# Altium schematic sheet WIFI_BT.SchDoc
size A3
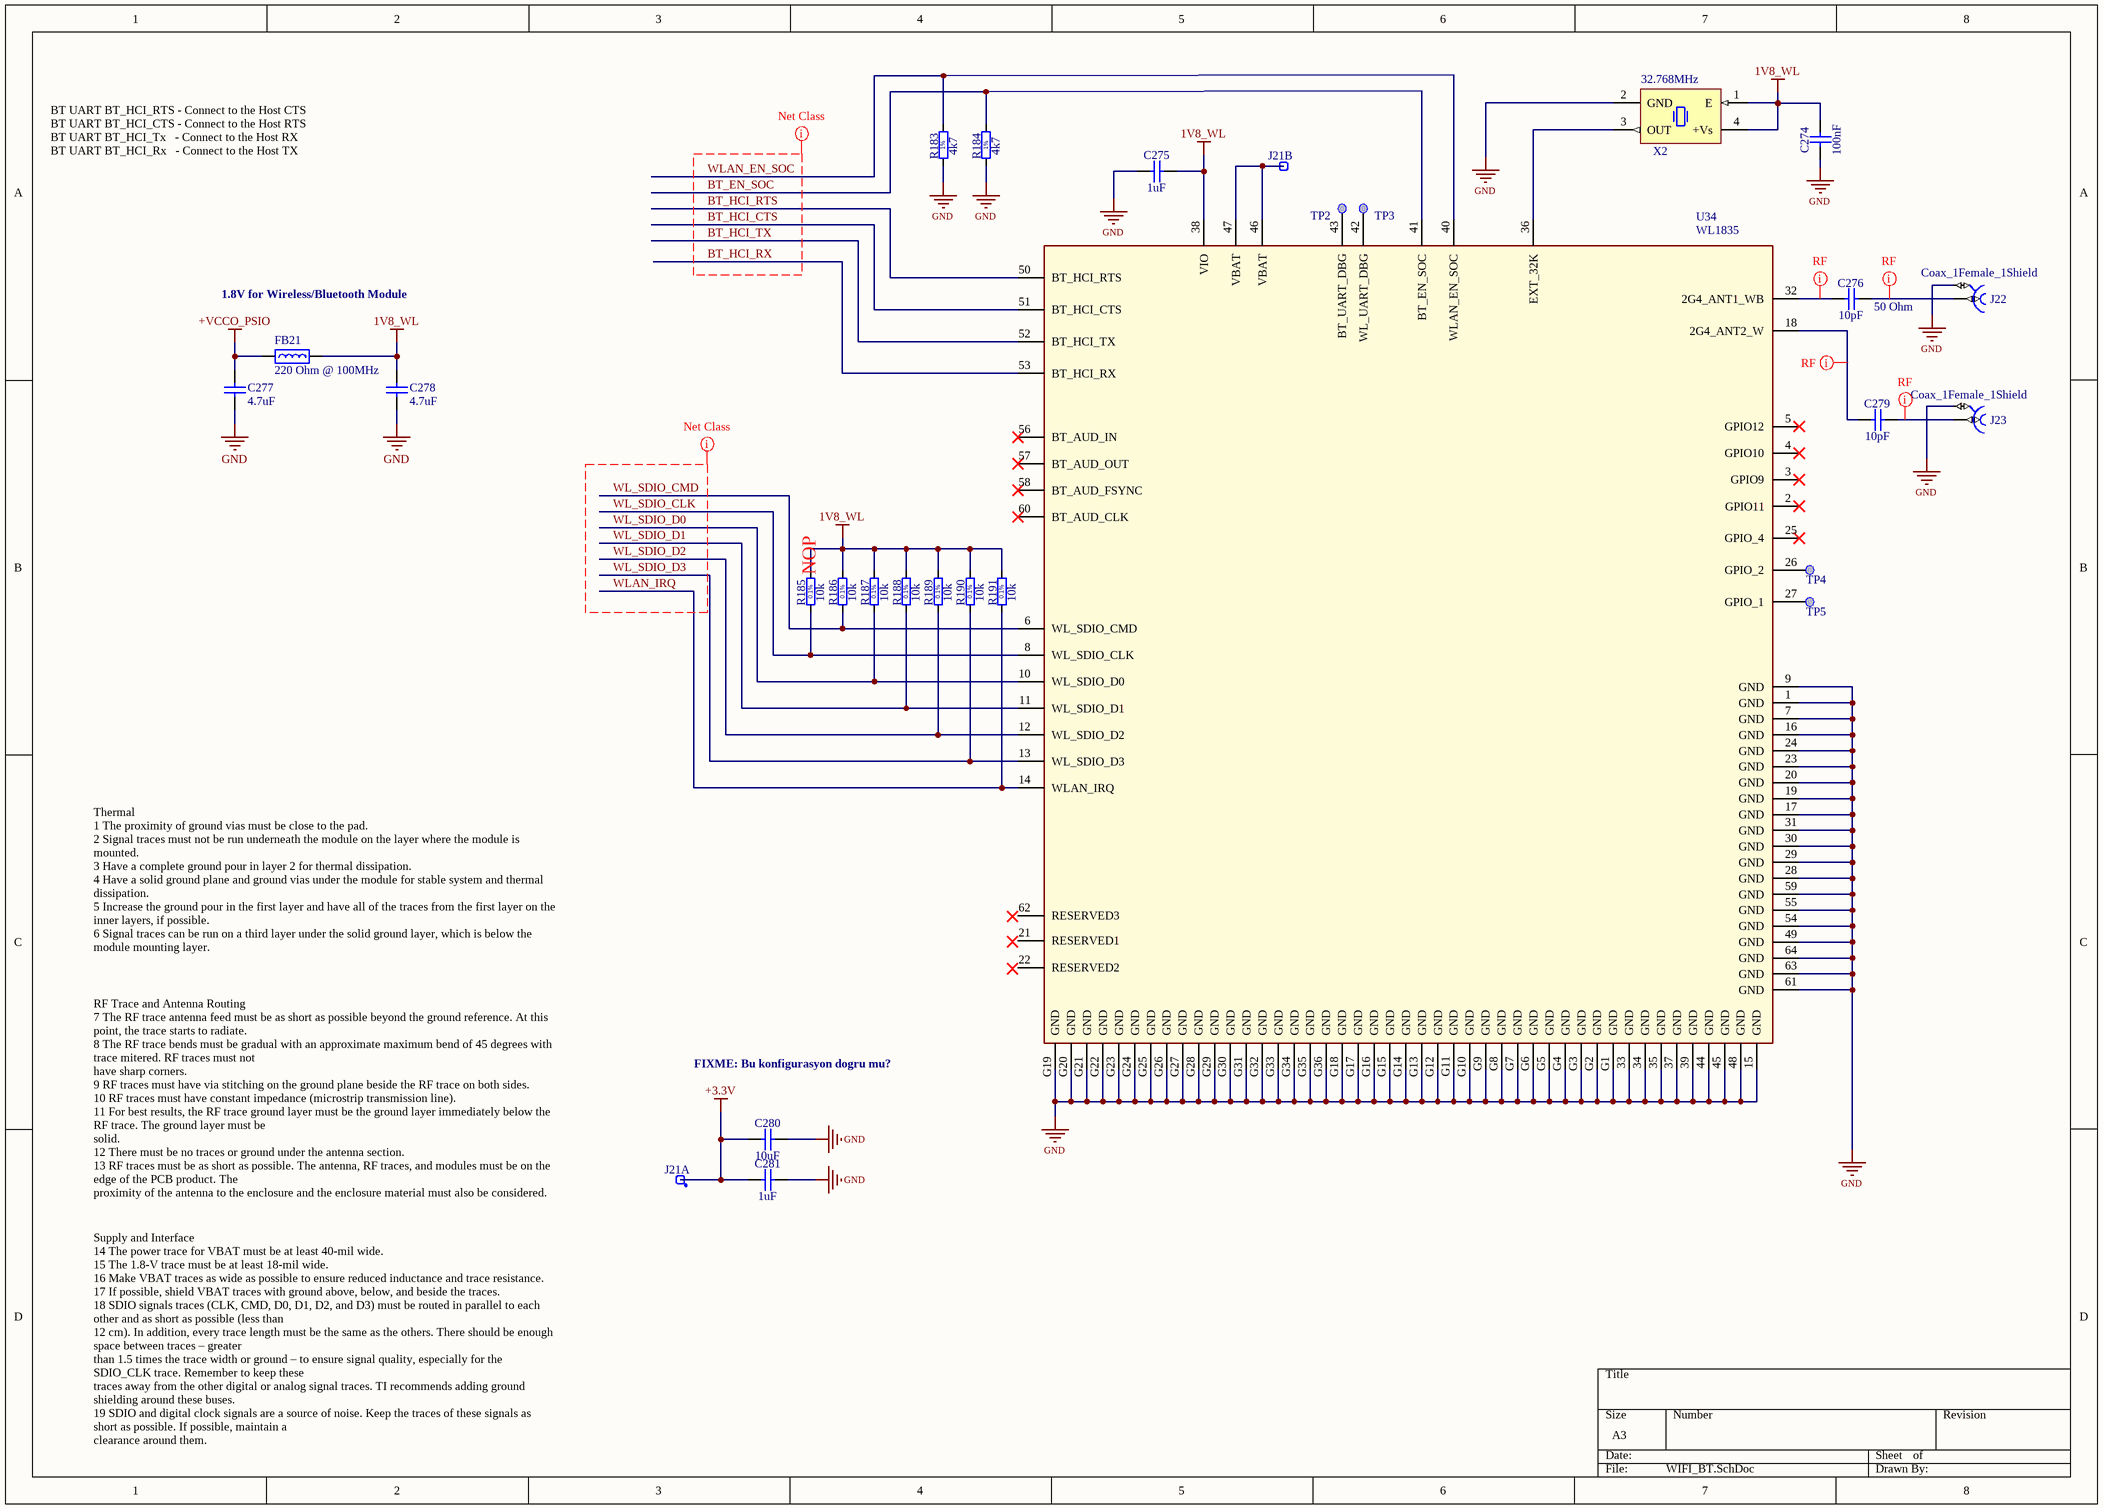
[diagram p0: WIFI_BT.SchDoc]

## Parts
C274  100nF  [CAPC1608X87N]
C275  1uF  [CAPC1608X87N]
C276  10pF  [CAPC1608X87N]
C277  4.7uF  [CAPC1005L_0402]
C278  4.7uF  [CAPC1005L_0402]
C279  10pF  [CAPC1608X87N]
C280  10uF  [CAPC2012X135N]
C281  1uF  [CAPC1608X87N]
FB21  Impedance @ Frequency: 220 Ohm @ 100MHz  [INDC1608N_0603]  (hidden comment: BEAD0603_220_2A5_40M)
J21  Test Point  [COMATEL_385.0358.1.02.400]  (value not drawn)  (parts A,B of 2)
J22  Coax_1Female_1Shield  [HUBER-SUHNER_82 SMA-50-0-41/133 NE]
J23  Coax_1Female_1Shield  [HUBER-SUHNER_82 SMA-50-0-41/133 NE]
R183  4k7  [RESC1608X55N]
R184  4k7  [RESC1608X55N]
R185  10k  [RESC1608X55N]
R186  10k  [RESC1608X55N]
R187  10k  [RESC1608X55N]
R188  10k  [RESC1608X55N]
R189  10k  [RESC1608X55N]
R190  10k  [RESC1608X55N]
R191  10k  [RESC1608X55N]
TP2  TP  [TP]  (value not drawn)  (no BOM)
TP3  TP  [TP]  (value not drawn)  (no BOM)
TP4  TP  [TP]  (value not drawn)  (no BOM)
TP5  TP  [TP]  (value not drawn)  (no BOM)
U34  WL1835  [E-13.4X13.3-N100_0.75-TOP]
X2  32.768MHz  [OSCSC508P500X700X180-4N]

## Nets
1V8_WL: C274.2 C275.2 C278.2 FB21.2 R185.2 R186.2 R187.2 R188.2 R189.2 R190.2 R191.2 U34.38(VIO) X2.1(E) X2.4(+Vs)
+3.3V: C280.1 C281.1 J21.1
+VCCO_PSIO: C277.2 FB21.1
GND: C274.1 C275.1 C277.1 C278.1 C280.2 C281.2 J22.2 J23.2 R183.1 R184.1 U34.1(GND) U34.7(GND) U34.9(GND) U34.15(GND) U34.16(GND) U34.17(GND) U34.19(GND) U34.20(GND) U34.23(GND) U34.24(GND) U34.28(GND) U34.29(GND) U34.30(GND) U34.31(GND) U34.33(GND) U34.34(GND) U34.35(GND) U34.37(GND) U34.39(GND) U34.44(GND) U34.45(GND) U34.48(GND) U34.49(GND) U34.54(GND) U34.55(GND) U34.59(GND) U34.61(GND) U34.63(GND) U34.64(GND) U34.G1(GND) U34.G2(GND) U34.G3(GND) U34.G4(GND) U34.G5(GND) U34.G6(GND) U34.G7(GND) U34.G8(GND) U34.G9(GND) U34.G10(GND) U34.G11(GND) U34.G12(GND) U34.G13(GND) U34.G14(GND) U34.G15(GND) U34.G16(GND) U34.G17(GND) U34.G18(GND) U34.G19(GND) U34.G20(GND) U34.G21(GND) U34.G22(GND) U34.G23(GND) U34.G24(GND) U34.G25(GND) U34.G26(GND) U34.G27(GND) U34.G28(GND) U34.G29(GND) U34.G30(GND) U34.G31(GND) U34.G32(GND) U34.G33(GND) U34.G34(GND) U34.G35(GND) U34.G36(GND) X2.2(GND)
BT_EN_SOC: R184.2 U34.41(BT_EN_SOC)
BT_HCI_CTS: U34.51(BT_HCI_CTS)
BT_HCI_RTS: U34.50(BT_HCI_RTS)
BT_HCI_RX: U34.53(BT_HCI_RX)
BT_HCI_TX: U34.52(BT_HCI_TX)
WL_SDIO_CLK: R185.1 U34.8(WL_SDIO_CLK)
WL_SDIO_CMD: R186.1 U34.6(WL_SDIO_CMD)
WL_SDIO_D0: R187.1 U34.10(WL_SDIO_D0)
WL_SDIO_D1: R188.1 U34.11(WL_SDIO_D1)
WL_SDIO_D2: R189.1 U34.12(WL_SDIO_D2)
WL_SDIO_D3: R190.1 U34.13(WL_SDIO_D3)
WLAN_EN_SOC: R183.2 U34.40(WLAN_EN_SOC)
WLAN_IRQ: R191.1 U34.14(WLAN_IRQ)
NetC276_1: C276.1 U34.32(2G4_ANT1_WB)
NetC276_2: C276.2 J22.1
NetC279_1: C279.1 U34.18(2G4_ANT2_W)
NetC279_2: C279.2 J23.1
NetJ21_2: J21.2 U34.46(VBAT) U34.47(VBAT)
NetTP2_1: TP2.1 U34.43(BT_UART_DBG)
NetTP3_1: TP3.1 U34.42(WL_UART_DBG)
NetTP4_1: TP4.1 U34.26(GPIO_2)
NetTP5_1: TP5.1 U34.27(GPIO_1)
NetU34_36: U34.36(EXT_32K) X2.3(OUT)

Not connected (* = marked no-connect by the designer): U34 2(GPIO11)* 3(GPIO9)* 4(GPIO10)* 5(GPIO12)* 21(RESERVED1) 22(RESERVED2) 25(GPIO_4)* 56(BT_AUD_IN)* 57(BT_AUD_OUT)* 58(BT_AUD_FSYNC)* 60(BT_AUD_CLK)* 62(RESERVED3)

## Layout directives
net class RF: NetC276_1, NetC276_2, NetC279_1, NetC279_2
net class BLU_SPI: BT_EN_SOC, BT_HCI_CTS, BT_HCI_RTS, BT_HCI_RX, BT_HCI_TX, WLAN_EN_SOC
net class WL_SDIO: WL_SDIO_CLK, WL_SDIO_CMD, WL_SDIO_D0, WL_SDIO_D1, WL_SDIO_D2, WL_SDIO_D3, WLAN_IRQ

## Notes on the sheet
- BT UART	BT_HCI_RTS - Connect to the Host CTS
  BT UART	BT_HCI_CTS - Connect to the Host RTS
  BT UART	BT_HCI_Tx   - Connect to the Host RX
  BT UART	BT_HCI_Rx   - Connect to the Host TX
- 1.8V for Wireless/Bluetooth Module
- (near C276) 50 Ohm
- (near R185) NOP
- Thermal
  1 The proximity of ground vias must be close to the pad.
  2 Signal traces must not be run underneath the module on the layer where the module is mounted.
  3 Have a complete ground pour in layer 2 for thermal dissipation.
  4 Have a solid ground plane and ground vias under the module for stable system and thermal dissipation.
  5 Increase the ground pour in the first layer and have all of the traces from the first layer on the inner layers, if possible.
  6 Signal traces can be run on a third layer under the solid ground layer, which is below the module mounting layer.
- FIXME: Bu konfigurasyon dogru mu?
- RF Trace and Antenna Routing
  7 The RF trace antenna feed must be as short as possible beyond the ground reference. At this point, the trace starts to radiate.
  8 The RF trace bends must be gradual with an approximate maximum bend of 45 degrees with trace mitered. RF traces must not
  have sharp corners.
  9 RF traces must have via stitching on the ground plane beside the RF trace on both sides.
  10 RF traces must have constant impedance (microstrip transmission line).
  11 For best results, the RF trace ground layer must be the ground layer immediately below the RF trace. The ground layer must be
  solid.
  12 There must be no traces or ground under the antenna section.
  13 RF traces must be as short as possible. The antenna, RF traces, and modules must be on the edge of the PCB product. The
  proximity of the antenna to the enclosure and the enclosure material must also be considered.
- Supply and Interface
  14 The power trace for VBAT must be at least 40-mil wide.
  15 The 1.8-V trace must be at least 18-mil wide.
  16 Make VBAT traces as wide as possible to ensure reduced inductance and trace resistance.
  17 If possible, shield VBAT traces with ground above, below, and beside the traces.
  18 SDIO signals traces (CLK, CMD, D0, D1, D2, and D3) must be routed in parallel to each other and as short as possible (less than
  12 cm). In addition, every trace length must be the same as the others. There should be enough space between traces – greater
  than 1.5 times the trace width or ground – to ensure signal quality, especially for the SDIO_CLK trace. Remember to keep these
  traces away from the other digital or analog signal traces. TI recommends adding ground shielding around these buses.
  19 SDIO and digital clock signals are a source of noise. Keep the traces of these signals as short as possible. If possible, maintain a
  clearance around them.
- (in symbol R0603_4K7_1%_0.1W_100PPM) 1%
- (in symbol R0603_10K_0.1%_0.063W_10PPM) 0.1%

## Library data of the parts
C274 = CC0603_100NF_50V_10%_X7R: Non-polarised capacitor; Part Description: SMD Multilayer Chip Ceramic Capacitor; Manufacturer: MULTICOMP; Manufacturer Part Number: MCB0603R104KCT; Manufacturer1 Part Number: 223858615649; Voltage: 50V; TC: X7R; Tolerance: ±10%; Table: Capacitors SMD; Voltage Rating: 16; Capacitance Tolerance ±: ± 10%; Dielectric Characteristic: X7; Capacitance: 0.1; SVHC: No SVHC (17-Dec-2015); Capacitor Terminals: SMD; Ceramic Capacitor Case: 0603 [1608 Metric]; Product Range: MCB Series; Part Number: CC0603_100NF_50V_10%_X7R; Component Kind: Standard; Component Type: Standard; Pin Count: 2; Value: 100nF; Status: Preferred; Case: 0603; Mounted: Yes; Socket: No; SMD: Yes; Manufacturer1 Example: PHYCOMP; Manufacturer1 ComponentHeight: 0.87mm; HelpURL: \\cern.ch\dfs\Applications\Altium\Datasheets\CC0603_X7R_PHYCOMP.pdf; Author: CERN DEM JLC; CreateDate: 03.12.2007; LatestRevisionDate: 03.12.2007; Supplier: Farnell; Capacitance Tolerance: ± 10%; Supplier Part Number: 9406140; RoHS: YES; Packaging: Cut Tape; MSL: -; Operating Temperature Max: 125; Operating Temperature Range: -55°C to +125°C<!--FANDB--><div class="features-and-benefits-container"><div class="features-and-benefits-description"><span class="features-benefits-value">The MCB0603R104KCT is a multilayer Ceramic Capacitor with 0603 chip, for general digital circuit. Consists of a conducting material and electrodes. To manufacture a chip-type SMT and achieve miniaturization, high density and high efficiency, ceramic condensers are used. MLCC is made by X7; Operating Temperature Min: -55
C275 C281 = CC0603_1UF_25V_10%_X7R: Non-polarised capacitor; Part Description: SMD Multilayer Chip Ceramic Capacitor; Manufacturer: MULTICOMP; Manufacturer Part Number: MC0603F104Z250CT; Manufacturer1 Part Number: GRM188R71E105KA12D; Voltage: 25V; TC: X7R; Tolerance: ±10%; Table: Capacitors SMD; Capacitance: 0.1; Capacitance Tolerance: +80%, -20%; No. of Pins: 2; Product Range: MC Series; External Length / Height: 0.8; Dielectric Characteristic: Y5; Ceramic Capacitor Case: 0603 [1608 Metric]; Capacitor Terminals: SMD; External Depth: 1.6; SVHC: No SVHC (17-Dec-2015); Voltage Rating: 25; Part Number: CC0603_1UF_25V_10%_X7R; Component Kind: Standard; Component Type: Standard; Pin Count: 2; Value: 1uF; Status: None; Case: 0603; Mounted: Yes; Socket: No; SMD: Yes; Manufacturer1 Example: MURATA; Manufacturer1 ComponentHeight: 0.9mm; HelpURL: \\cern.ch\dfs\Applications\Altium\Datasheets\CC0603_X7R_MURATA.pdf; Author: CERN DEM JLC; CreateDate: 18.01.2011; LatestRevisionDate: 18.01.2011; MSL: -; Supplier Part Number: 1759038; Capacitance Tolerance ±: +80%, -20%; External Width: 0.8; Operating Temperature Range: -25°C to +85°C<!--FANDB--><div class="features-and-benefits-container"><div class="features-and-benefits-description"><span class="features-benefits-value">The MC0603F104Z250CT is a general purpose Multilayer Ceramic Capacitor with Cu/Ni/Sn-plated termination, Y5V dielectric and 0603 case. The multilayer ceramic capacitor consists of a conducting material and electrodes. To manufacture a chip-type SMT and achieve miniaturization, high density and high efficiency, ceramic condensers are used. High electrical precision, stability and reliability.</span></div><div class="features-and-benefits-list"><ul class="features-and-benefits-list-list"><li class="features-and-benefits-list-item">High capacitance</li></ul></div><div class="features-and-benefits-applications"><ul class="features-and-benefits-value"><li class="features-and-benefits-list-item">Power Management</li><li class="features-and-benefits-list-item">Consumer Electronics</li><li class="features-and-benefits-list-item">Communications & Networking</li></ul></div></div>; Supplier: Farnell; Packaging: Cut Tape; Operating Temperature Max: 85; Operating Temperature Min: -30; RoHS: YES
C276 C279 = CC0603_10PF_50V_5%_NP0: Non-polarised capacitor; Part Description: SMD Multilayer Chip Ceramic Capacitor; Manufacturer: Yageo; Manufacturer Part Number: CC0603JRNPO9BN100; Manufacturer1 Part Number: 223886715109; Voltage: 50V; TC: NP0; Tolerance: ±5%; Table: Capacitors SMD; Temperature Coefficient: C0G, NP0; Part Number: CC0603_10PF_50V_5%_NP0; Component Kind: Standard; Component Type: Standard; Pin Count: 2; Value: 10pF; Status: Preferred; Case: 0603; Mounted: Yes; Socket: No; SMD: Yes; Manufacturer1 Example: PHYCOMP; Manufacturer1 ComponentHeight: 0.87mm; HelpURL: \\cern.ch\dfs\Applications\Altium\Datasheets\CC0603_NP0_PHYCOMP.pdf; Author: CERN DEM JLC; CreateDate: 3.12.2007; LatestRevisionDate: 3.12.2007; Packaging: Tape & Reel (TR); Features: -; RoHS: RoHS Compliant; Applications: General Purpose; Category: Capacitors; Operating Temperature: -55°C ~ 125°C; Height - Seated (Max): -; Supplier Part Number: 311-1058-2-ND; Ratings: -; Lead Style: -; Thickness (Max): 0.035" (0.90mm); Lead Spacing: -; Mounting Type: Surface Mount, MLCC; Size / Dimension: 0.063" L x 0.031" W (1.60mm x 0.80mm); Voltage - Rated: 50V; Supplier: Digi-Key; Package / Case: 0603 (1608 Metric); Capacitance: 10pF
C277 C278 = CAPCER0402X5R4U710V_10T: CAP CER 4.7UF 10V X5R 0402; Manufacturer 1: TDK Corporation; Manufacturer Part Number 1: C1005X5R1A475K050BC; Tolerance: 10%; Package: 0402; ComponentLink1Description: Datasheet; Value: 4.7uF; Voltage: 10V; Temperature Coefficient: x5R; Supplier 1: Digi-Key; Supplier Part Number 1: 445-13820-1-ND; Operating Temperature: -55°C ~ 85°C
C280 = CC0805_10UF_10V_10%_X7R: Non-polarised capacitor; Part Description: SMD Multilayer Chip Ceramic Capacitor; Manufacturer: MULTICOMP; Manufacturer Part Number: MC0805X106K250CT; Manufacturer1 Part Number: GRM21BR71A106KE51L; Voltage: 10V; TC: X7R; Tolerance: ±10%; Table: Capacitors SMD; Product Range: MC Series; Voltage Rating: 25; Capacitor Terminals: SMD<!--FANDB--><div class="features-and-benefits-container"><div class="features-and-benefits-description"><span class="features-benefits-value">The MC series from Multicomp are general purpose MLCC capacitors with X5R dielectric material which provides high electrical precision, stability and reliability. This MLCC capacitor consists of a conducting material and electrodes with high density and high efficiency ceramic condensers.</span></div><div class="features-and-benefits-list"><ul class="features-and-benefits-list-list"><li class="features-and-benefits-list-item">Small size with higher capacitance values</li><li class="features-and-benefits-list-item">0201, 0402, 0603, 0805, 1206, 1210, 1812 case sizes available</li><li class="features-and-benefits-list-item">Capacitance values ranges from 100pF to 220?F</li><li class="features-and-benefits-list-item">Capacitor with lead free termination (pure Tin)</li><li class="features-and-benefits-list-item">High electrical precision, stability and reliability</li><li class="features-and-benefits-list-item">Rated voltage of 4V, 6.3V, 10V, 16V, 25V, 50V</li><li class="features-and-benefits-list-item">Operating temperature range -55°C to +85°C</li><li class="features-and-benefits-list-item">Available in ±10% and ±20; Dielectric Characteristic: X5; Ceramic Capacitor Case: 0805 [2012 Metric]; Capacitance Tolerance ±: ± 10%; SVHC: No SVHC (15-Jun-2015); Capacitance: 10; Part Number: CC0805_10UF_10V_10%_X7R; Component Kind: Standard; Component Type: Standard; Pin Count: 2; Value: 10uF; Status: Preferred; Case: 0805; Mounted: Yes; Socket: No; SMD: Yes; Manufacturer1 Example: MURATA; Manufacturer1 ComponentHeight: 1.35mm; HelpURL: \\cern.ch\dfs\Applications\Altium\Datasheets\CC0805_X7R_MURATA.pdf; Author: CERN DEM JLC; CreateDate: 30.04.2012; LatestRevisionDate: 30.04.2012; Operating Temperature Min: -55; MSL: MSL 1 - Unlimited; Supplier: Farnell; RoHS: YES; Capacitance Tolerance: ± 10%; Packaging: Cut Tape; Supplier Part Number: 2320833; Operating Temperature Max: 85
FB21 = BEAD0603_220_2A5_40M: FERRITE BEAD 220 OHM 0603 1LN; Manufacturer 1: Murata Electronics North America; Manufacturer Part Number 1: BLM18SG221TN1D; Current Rating (Max): 2.5A; DC Resistance (DCR) (Max): 40 mohm; Package: 0603; ComponentLink1Description: Datasheet; ComponentLink1URL: C:\Users\Public\Documents\Altium\AD16\Library\PDF\ENFA0003.pdf; Supplier 1: Digi-Key; Supplier Part Number 1: 490-5225-1-ND; Operating Temperature: -55°C ~ 125°C
J21 = COMATEL_385.0358.1.02.400: 2 Mini Wire-Wrap Contact Strip Header; Part Description: 2 Contacts Straight Strip Header Pitch 2.54mm L=6.3mm ''Mini-Wire-Wrap''; Manufacturer: KONTEK COMATEL; Part Number: COMATEL_385.0358.1.02.400; Component Kind: Standard; Component Type: Standard; Pin Count: 2; Family: Test Point; Mounted: Yes; Socket: No; SMD: No; Status: Not recommended; Manufacturer Part Number: 385.0358.1.02.400; ComponentHeight: 8mm; HelpURL: \\cern.ch\dfs\Applications\Altium\Datasheets\COMATEL_385.0358.1.02.400.pdf; Author: CERN DEM JLC; CreateDate: 30.06.2010; LatestRevisionDate: 10.10.2012; Table: COMATEL
J22 J23 = HUBER-SUHNER_82_SMA-50-0-41/133_NE: Part Description: SMA 50 Ohms Straight PCB Jack; Manufacturer: AMPHENOL CONNEX; Manufacturer Part Number: 132134; Table: Miscellaneous; Part Number: HUBER-SUHNER_82_SMA-50-0-41/133_NE; Component Kind: Standard; Component Type: Standard; Pin Count: 2; Family: SMA; Mounted: Yes; Socket: No; SMD: No; Status: None; ComponentHeight: 9.6mm; HelpURL: \\cern.ch\dfs\Applications\Altium\Datasheets\HUBER-SUHNER_82 SMA-50-0-41-133 NE.pdf; Author: CERN DEM JLC; CreateDate: 20.04.2010; LatestRevisionDate: 27.04.2010; Supplier: Farnell; RoHS: YES; Supplier Part Number: 2112465
R183 R184 = R0603_4K7_1%_0.1W_100PPM: Resistor - 1%; Part Description: General Purpose Thick Film Chip Resistor; Manufacturer: Yageo; Manufacturer Part Number: RC0603JR-074K7L; Manufacturer1 Part Number: NRC06F4701TRF; Power: 0.1W; TC: ±100ppm/°C; Tolerance: ±5%; Table: Resistors SMD; Resistance (Ohms): 4.7k; Power (Watts): 0.1W, 1/10W; Part Number: R0603_4K7_1%_0.1W_100PPM; Component Kind: Standard; Component Type: Standard; Pin Count: 2; Value: 4k7; Status: Preferred; Case: 0603; Mounted: Yes; Socket: No; SMD: Yes; Manufacturer1 Example: NIC COMPONENT; Manufacturer1 ComponentHeight: 0.55mm; HelpURL: \\cern.ch\dfs\Applications\Altium\Datasheets\R0603_NIC_NRC.pdf; Author: CERN DEM JLC; CreateDate: 3.12.2007; LatestRevisionDate: 13.03.2008; Size / Dimension: 0.063" L x 0.031" W (1.60mm x 0.80mm); Supplier Device Package: 0603; Supplier: Digi-Key; Features: Moisture Resistant; Package / Case: 0603 (1608 Metric); Category: Resistors; Temperature Coefficient: ±100ppm/°C; Number of Terminations: 2; Packaging: Cut Tape (CT); Height: 0.022" (0.55mm); Composition: Thick Film; RoHS: RoHS Compliant; Operating Temperature: -55°C ~ 155°C; Supplier Part Number: 311-4.7KGRCT-ND
R185-R191 = R0603_10K_0.1%_0.063W_10PPM: Resistor - 0.1%; Part Description: Thin Film Chip Resistor; Manufacturer: Panasonic Electronic Components; Manufacturer Part Number: ERJ-3GEYJ103V; Manufacturer1 Part Number: RN73C1J10KBTDF; Power: 0.063W; TC: ±10ppm; Tolerance: ±5%; Table: Resistors SMD; Temperature Coefficient: ±200ppm/°C; Power (Watts): 0.1W, 1/10W; Part Number: R0603_10K_0.1%_0.063W_10PPM; Component Kind: Standard; Component Type: Standard; Pin Count: 2; Value: 10k; Status: Not recommended; Case: 0603; Mounted: Yes; Socket: No; SMD: Yes; Manufacturer1 Example: TYCO HOLSWORTHY; Manufacturer1 ComponentHeight: 0.5mm; HelpURL: \\cern.ch\dfs\Applications\Altium\Datasheets\R0603_Tyco_RN73.pdf; Author: CERN DEM JLC; CreateDate: 3.12.2007; LatestRevisionDate: 13.03.2008; Supplier: Digi-Key; Supplier Part Number: P10KGDKR-ND; Category: Resistors; Height: 0.022" (0.55mm); Operating Temperature: -55°C ~ 155°C; Number of Terminations: 2; Composition: Thick Film; Features: Automotive AEC-Q200; RoHS: RoHS Compliant; Supplier Device Package: 0603; Size / Dimension: 0.063" L x 0.031" W (1.60mm x 0.80mm); Packaging: Digi-Reel®; Resistance (Ohms): 10k; Package / Case: 0603 (1608 Metric)
TP2-TP5 = Test Point
U34 = WL1835: MODULE WIFI WILINK; Manufacturer Part Number: WL1835MODGBMOCR; Manufacturer: Texas Instruments; Voltage - Supply: 2.9 V ~ 4.8 V; Power - Output: 17.3dBm; Sensitivity: -96.3dBm; Protocol: 802.11a/b/g/n, Bluetooth v4.1 Low Energy (BLE); Frequency: 2.4GHz ~ 2.48GHz; Current - Receiving: 85mA; Data Rate: 100Mbps; RF Family/Standard: Bluetooth, WiFi; Current - Transmitting: 420mA; Antenna Type: Integrated, Chip; Serial Interfaces: UART; Category: RF/IF and RFID; Modulation: -; Memory Size: -; Supplier: Digi-Key; RoHS: RoHS Compliant By Exemption; Packaging: Tape & Reel (TR); Package / Case: Module; Operating Temperature: -40°C ~ 85°C; Mounting Type: Surface Mount; Supplier Part Number: 296-38032-2-ND
X2 = OSC_32.7688MHZ_RAKON_LF SPXO019203: Oscillator 4 pins 1=E 2=GND 3=OUT 4=+Vs; Part Description: 3.3V ±50ppm Tri-State Surface Mount HCCMOS Clock Oscillator (CFPS-73 Serie); Manufacturer: EPSON; Manufacturer Part Number: SG-3030JF 32.7680KB0: ROHS; Table: Crystals & Oscillators; Frequency: 32.768kHz; Output: CMOS; Voltage - Supply: 1.5 V ~ 5.5 V; Current - Supply (Max): 2µA; Part Number: OSC_32.7688MHZ_RAKON_LF SPXO019203; Component Kind: Standard; Component Type: Standard; PackageDescription: SMD Oscillator, side convave, 4 pins, 5.00x7.00mm; Value: 32.768MHz; Pin Count: 4; Mounted: Yes; Socket: No; SMD: Yes; ComponentHeight: 2mm; HelpURL: \\cern.ch\dfs\Applications\Altium\Datasheets\OSC_RAKON_CFPS.pdf; Author: CERN DEM JLC; CreateDate: 5.10.2009; LatestRevisionDate: 5.10.2009; Category: Crystals and Oscillators; Supplier Part Number: SG-3030JF 32.7680KB0: ROHS-ND; Supplier: Digi-Key; RoHS: RoHS Compliant; Packaging: Tape & Reel (TR); Type: XO (Standard); Function: -; Frequency Stability: -; Operating Temperature: -20°C ~ 70°C; Ratings: -; Mounting Type: Surface Mount; Size / Dimension: 0.280" L x 0.181" W (7.10mm x 4.60mm); Height: 0.059" (1.50mm); Package / Case: 4-SOJ; Current - Supply (Disable) (Max): -